# Altium schematic sheet Trigger.SchDoc
size A4
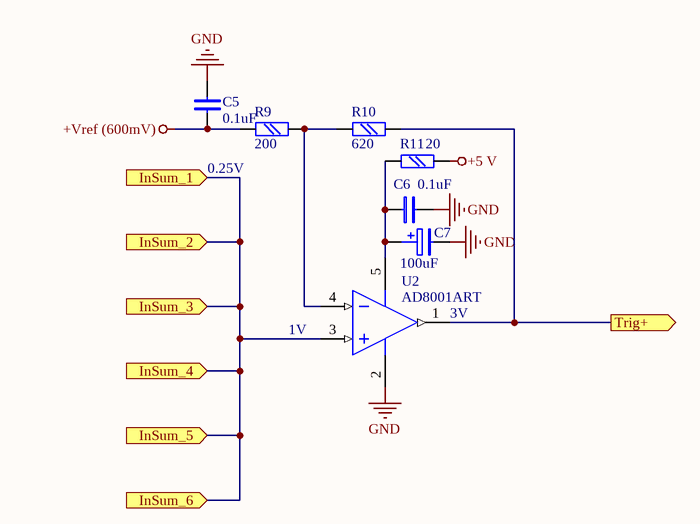
[diagram p0: Trigger.SchDoc]

## Parts
C5  0.1uF  [chip0603]
C6  0.1uF  [chip0603]
C7  100uF  [CEL-SMD300]
R9  200  [chip0603]
R10  620  [chip0603]
R11  20  [chip0603]
U2  AD8001ART  [RT-5]

## Ports
InSum_1 (in), InSum_2 (in), InSum_3 (in), InSum_4 (in), InSum_5 (in), InSum_6 (in), Trig+ (out)

## Nets
+5 V: R11.1
+Vref (600mV): C5.2 R9.2
GND: C5.1 C6.1 C7.- U2.2(V-)
InSum_1: U2.3(IN+) ; port InSum_1, port InSum_2, port InSum_3, port InSum_4, port InSum_5, port InSum_6
Trig+: R10.2 U2.1(OUT) ; port Trig+
NetC6_2: C6.2 C7.+ R11.2 U2.5(V+)
NetR9_1: R9.1 R10.1 U2.4(IN-)

## Notes on the sheet
- 0.25V
- (near U2) 1V
- (near U2) 3V

## Library data of the parts
C5 C6 = C: Text Field1: 20; Text Field2: 10
C7 = C POL: Text Field1: 20; Text Field2: 20
R9 R10 = R: Text Field1: 20; Text Field2: 20
R11 = R: Text Field1: 20; Text Field2: 20
U2 = AD8055ART: Low Cost, 300MHz Voltage Feedback Amplifier; Published: 8-Jun-2000; LatestRevisionDate: 17-Jul-2002; LatestRevisionNote: Re-released for DXP Platform.; DatasheetVersion: REV. 0 1997; PackageReference: RT-5; Publisher: Altium Limited; PackageDescription: SOT-23/SC-74A; 5 Leads; Body 3.1 x 3 mm, inc. leads (LxW max); Code_JEDEC: MO-178AA; ComponentLink1Description: Manufacturer Link; ComponentLink1URL: http://www.analog.com/en/prod/0,,759_786_AD8055%2C00.html; ComponentLink2Description: Datasheet; ComponentLink2URL: http://www.analog.com/UploadedFiles/Data_Sheets/40402558757264AD8055_6_i.pdf